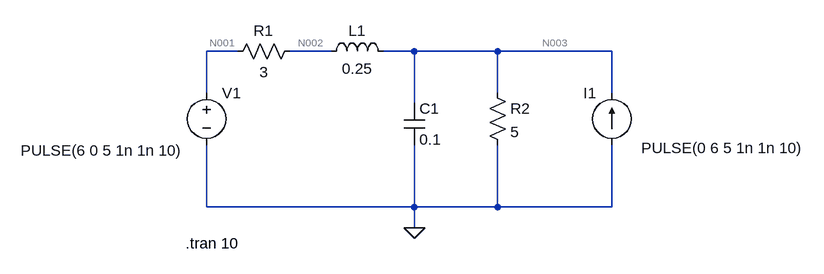
[diagram p0: schematic Task2.asc]
Task2.asc, the LTspice schematic file:
Version 4
SHEET 1 956 680
WIRE 80 80 32 80
WIRE 224 80 160 80
WIRE 352 80 304 80
WIRE 480 80 352 80
WIRE 656 80 480 80
WIRE 32 144 32 80
WIRE 480 144 480 80
WIRE 656 144 656 80
WIRE 352 160 352 80
WIRE 32 320 32 224
WIRE 352 320 352 224
WIRE 352 320 32 320
WIRE 480 320 480 224
WIRE 480 320 352 320
WIRE 656 320 656 224
WIRE 656 320 480 320
WIRE 352 352 352 320
FLAG 352 352 0
SYMBOL voltage 32 128 R0
WINDOW 123 0 0 Left 0
WINDOW 39 0 0 Left 0
WINDOW 3 -286 105 Left 2
SYMATTR InstName V1
SYMATTR Value PULSE(6 0 5 1n 1n 10)
SYMBOL res 176 64 R90
WINDOW 0 0 56 VBottom 2
WINDOW 3 32 56 VTop 2
SYMATTR InstName R1
SYMATTR Value 3
SYMBOL ind 208 96 R270
WINDOW 0 32 56 VTop 2
WINDOW 3 5 56 VBottom 2
SYMATTR InstName L1
SYMATTR Value 0.25
SYMBOL cap 336 160 R0
SYMATTR InstName C1
SYMATTR Value 0.1
SYMBOL res 464 128 R0
SYMATTR InstName R2
SYMATTR Value 5
SYMBOL current 656 224 R180
WINDOW 0 24 80 Left 2
WINDOW 3 -295 -5 Left 2
WINDOW 123 0 0 Left 0
WINDOW 39 0 0 Left 0
SYMATTR InstName I1
SYMATTR Value PULSE(0 6 5 1n 1n 10)
TEXT 0 376 Left 2 !.tran 10

The netlist it stands for:
* Task2.asc
V1 N001 0 PULSE(6 0 5 1n 1n 10)
R1 N002 N001 3
L1 N002 N003 0.25
C1 N003 0 0.1
R2 N003 0 5
I1 0 N003 PULSE(0 6 5 1n 1n 10)
.tran 10
.backanno
.end

* Results of the author's LTspice run, read from the files saved beside the schematic
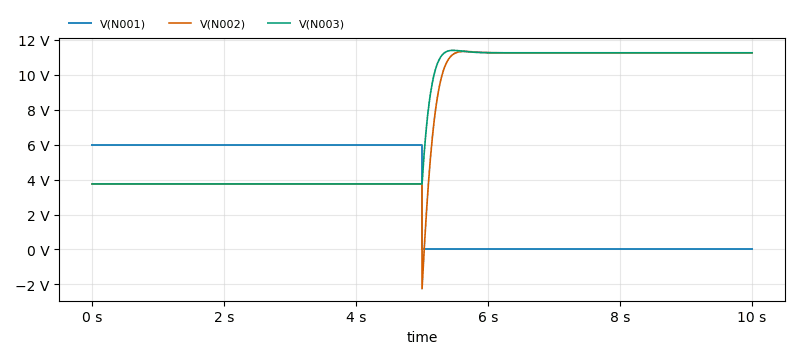
[diagram p1: Transient Analysis of Task2.asc, plotted from the saved traces]
* Transient Analysis, 1 run:
*   V(N001): min 0 V, max 6 V, average 3 V, rms 4.243 V, last 0 V
*   V(N002): min -2.25 V, max 11.33 V, average 7.316 V, rms 8.222 V, last 11.25 V
*   V(N003): min 3.75 V, max 11.39 V, average 7.43 V, rms 8.311 V, last 11.25 V